# Altium schematic sheet DA2_SCH_PAGE2.SchDoc
size A3; SheetNumber: 2; SheetTotal: 2
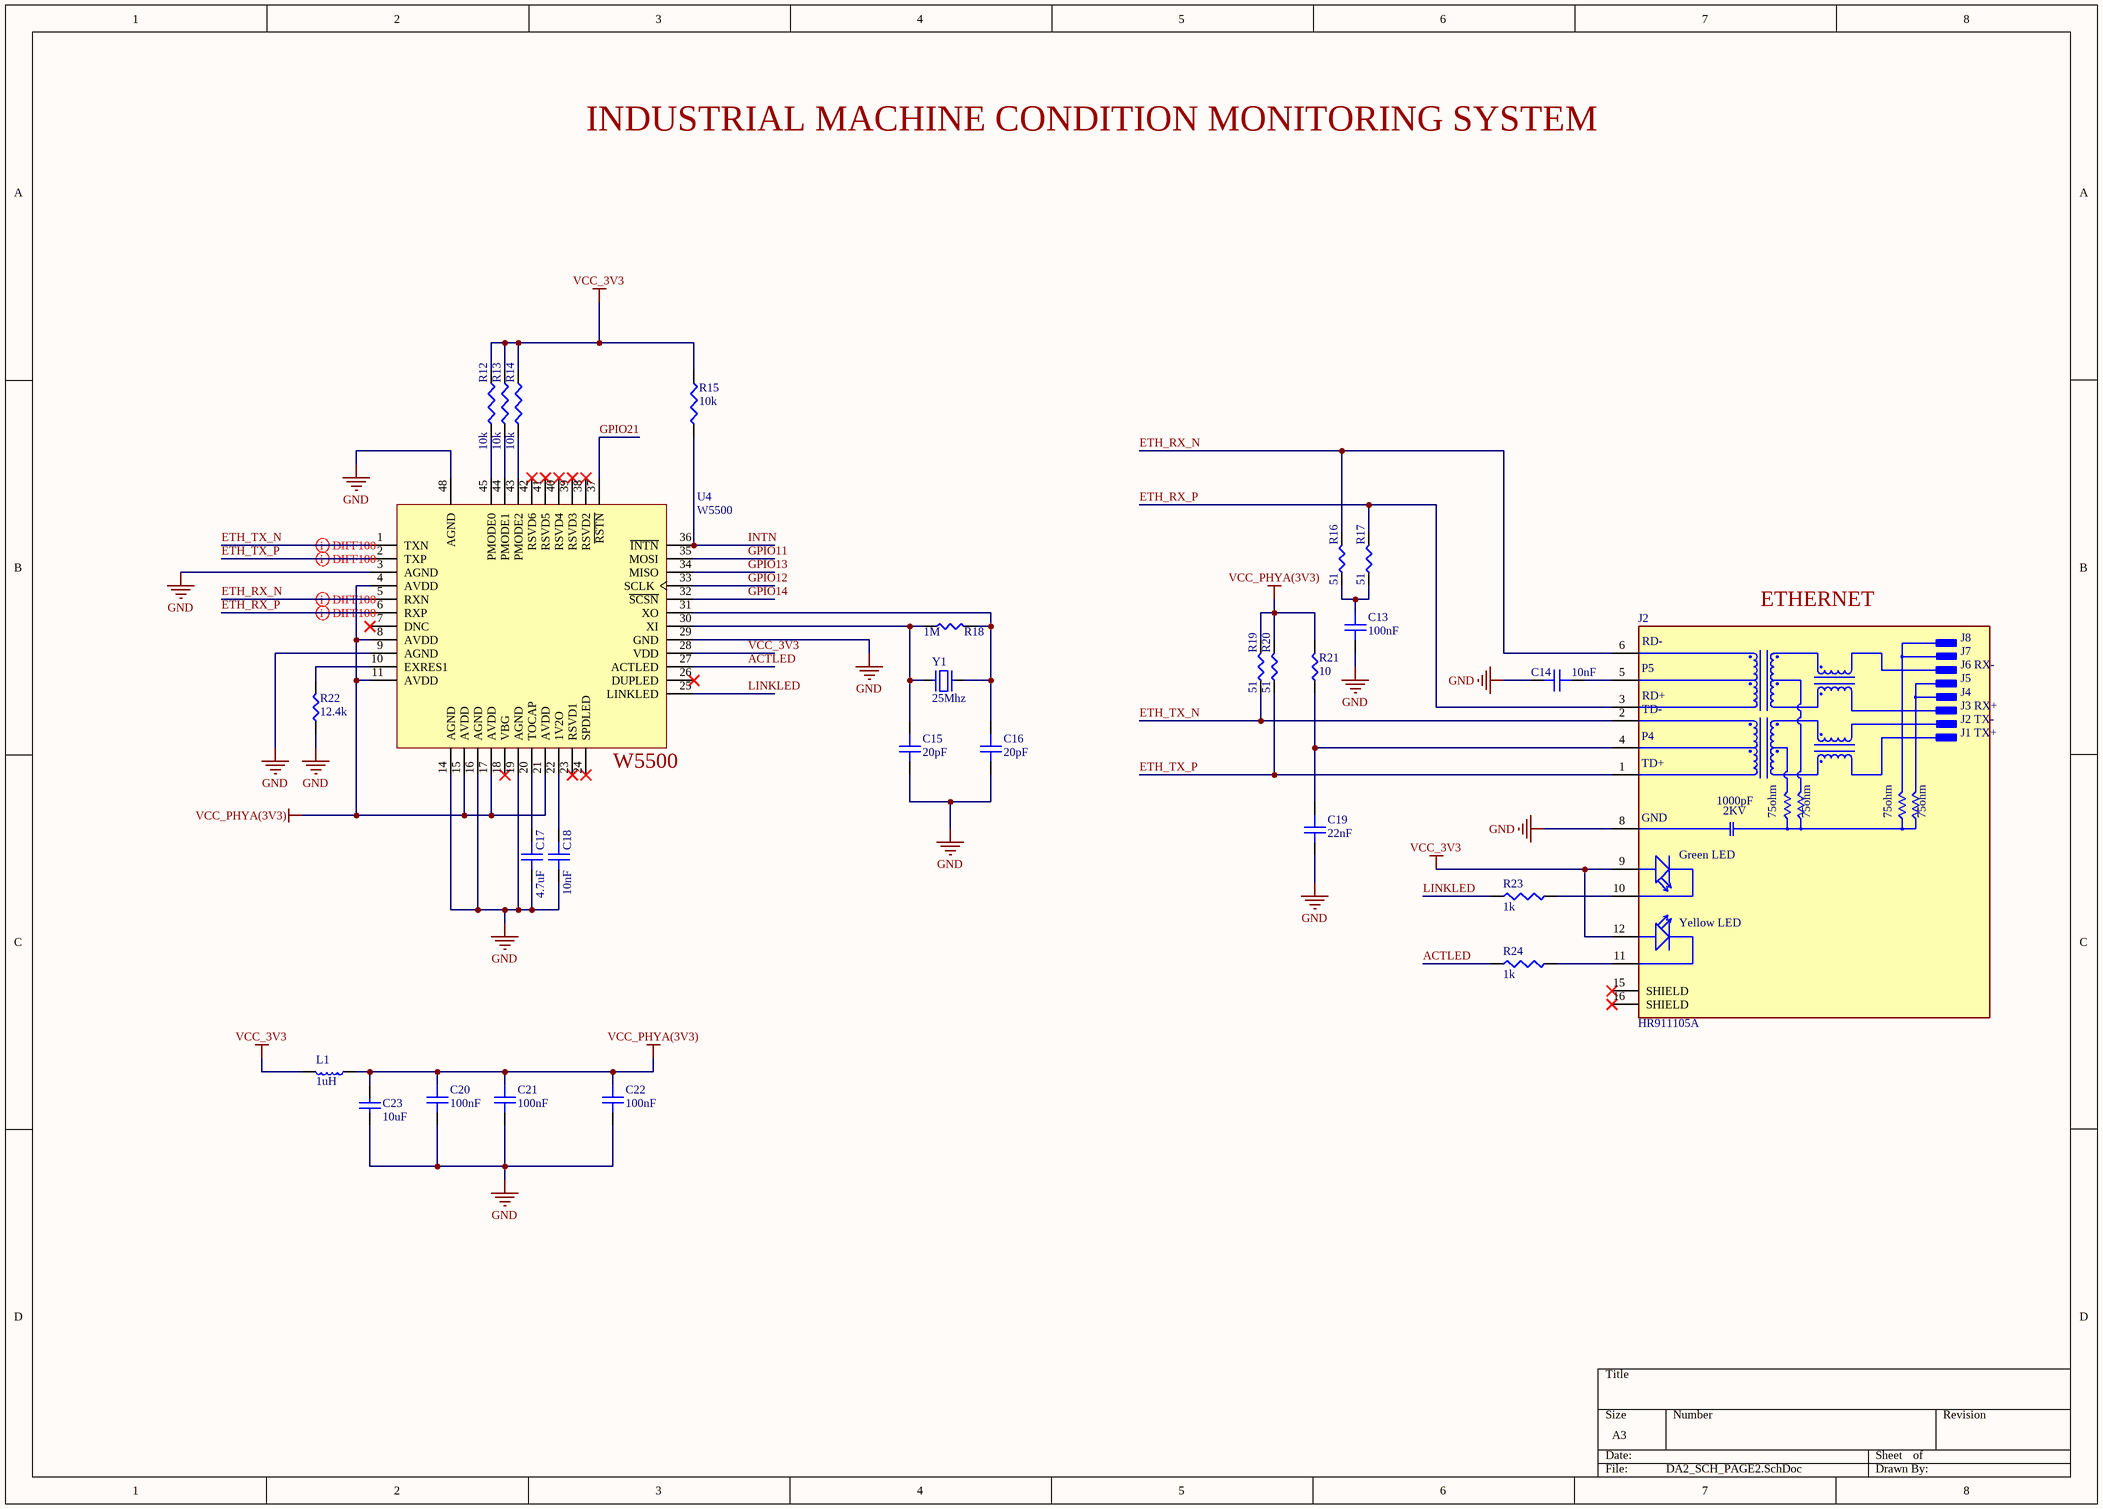
[diagram p0: DA2_SCH_PAGE2.SchDoc]

## Parts
C13  100nF  [tu 0805]
C14  10nF  [tu 0805]
C15  20pF  [tu 0805]
C16  20pF  [tu 0805]
C17  4.7uF  [Tu 0805]
C18  10nF  [tu 0805]
C19  22nF  [tu 0805]
C20  100nF  [tu 0805]
C21  100nF  [tu 0805]
C22  100nF  [tu 0805]
C23  10uF  [Tu 0805]
J2  HR911105A  [HANRUN_HR911105A]
L1  1uH  [Tu 0805]
R12  10k  [Tro SMD 0805]
R13  10k  [Tro SMD 0805]
R14  10k  [Tro SMD 0805]
R15  10k  [Tro SMD 0805]
R16  51  [tro smd 0805]
R17  51  [tro smd 0805]
R18  1M  [tro smd 0805]
R19  51  [tro smd 0805]
R20  51  [tro smd 0805]
R21  10  [tro smd 0805]
R22  12.4k  [tro smd 0805]
R23  1k  [Tro SMD 0805]
R24  1k  [Tro SMD 0805]
U4  W5500  [QFP50P900X900X160-48N]
Y1  25Mhz  [XTAL 25.000MHz]

## Nets
GND: C13.2 C14.2 C15.2 C16.2 C17.2 C18.2 C19.2 C20.2 C21.2 C22.2 C23.1 J2.8(GND) R22.1 U4.3(AGND) U4.9(AGND) U4.14(AGND) U4.16(AGND) U4.19(AGND) U4.29(GND) U4.48(AGND)
VCC_3V3: J2.9(GA) J2.12(YA) L1.1 R12.2 R13.2 R14.2 R15.2 U4.28(VDD)
VCC_PHYA(3V3): C20.1 C21.1 C22.1 C23.2 L1.2 R19.2 R20.2 R21.2 U4.4(AVDD) U4.8(AVDD) U4.11(AVDD) U4.15(AVDD) U4.17(AVDD) U4.21(AVDD)
ACTLED: R24.1 U4.27(ACTLED)
ETH_RX_N: J2.6(RD-) R16.2 U4.5(RXN)
ETH_RX_P: J2.3(RD+) R17.2 U4.6(RXP)
ETH_TX_N: J2.2(TD-) R19.1 U4.1(TXN)
ETH_TX_P: J2.1(TD+) R20.1 U4.2(TXP)
GPIO11: U4.35(MOSI)
GPIO12: U4.33(SCLK)
GPIO13: U4.34(MISO)
GPIO14: U4.32(~{SCSN})
GPIO21: U4.37(~{RSTN})
INTN: R15.1 U4.36(~{INTN})
LINKLED: R23.1 U4.25(LINKLED)
NetC13_1: C13.1 R16.1 R17.1
NetC14_1: C14.1 J2.5(P5)
NetC15_1: C15.1 R18.1 U4.30(XI) Y1.1
NetC16_1: C16.1 R18.2 U4.31(XO) Y1.2
NetC17_1: C17.1 U4.20(TOCAP)
NetC18_1: C18.1 U4.22(1V2O)
NetC19_1: C19.1 J2.4(P4) R21.1
NetJ2_10: J2.10(GC) R23.2
NetJ2_11: J2.11(YC) R24.2
NetR12_1: R12.1 U4.45(PMODE0)
NetR13_1: R13.1 U4.44(PMODE1)
NetR14_1: R14.1 U4.43(PMODE2)
NetR22_2: R22.2 U4.10(EXRES1)

Not connected (* = marked no-connect by the designer): J2 15(SHIELD)* 16(SHIELD)*; U4 7(DNC)* 18(VBG)* 23(RSVD1)* 24(SPDLED)* 26(DUPLED)* 38(RSVD2)* 39(RSVD3)* 40(RSVD4)* 41(RSVD5)* 42(RSVD6)*

## Layout directives
differential pair; differential pair class diff100: ETH_RX_N, ETH_RX_P, ETH_TX_N, ETH_TX_P

## Notes on the sheet
- INDUSTRIAL MACHINE CONDITION MONITORING SYSTEM
- ETHERNET
- (near U4) W5500
- (in symbol HR911105A) J8; J7; J6 RX-; J5; J4; J3 RX+; J2 TX-; J1 TX+; 1000pF; 2KV; 75ohm; Green LED; Yellow LED

## Library data of the parts
C13 C20-C22 = Tu 100nF: Dán 0805; Don_Vi: Con; So_Chan: 2; Ten_Linh_Kien: Tụ 0805 22nF 50V 20%; Ma_Hang: MH007857; Chung_Loai: Dán; Kieu_Chan: *
C14 C18 = Tu 10nF: Dán 0805; Don_Vi: Con; So_Chan: 2; Ten_Linh_Kien: Tụ 0805 22nF 50V 20%; Ma_Hang: MH007857; Chung_Loai: Dán; Kieu_Chan: *
C15 C16 = Tu  20pF: Dán 0805; Don_Vi: Con; Ten_Linh_Kien: Tụ 0805 20P 10% 50V; So_Chan: 2; Ma_Hang: MH004558; Chung_Loai: Dán; Kieu_Chan: *
C17 = Tu 4.7uF: Dán 0805; Ten_Linh_Kien: Tụ 0805 200p 10% 50V; Don_Vi: Con; So_Chan: 2; Ma_Hang: MH008100; Chung_Loai: Dán; Kieu_Chan: *
C19 = Tu 22nF: Dán 0805; Don_Vi: Con; Ten_Linh_Kien: Tụ 0805 20P 10% 50V; So_Chan: 2; Ma_Hang: MH004558; Chung_Loai: Dán; Kieu_Chan: *
C23 = Tu 10uF: Dán 0805; Manufacturer: Samsung Electro-Mechanics; Manufacturer Part Number: CL05A106MP5NUNC; Value: 10µF; Dielectric: X5R; Dielectric Material: Ceramic; Tolerance: 20%; Voltage Rating: 10V; Supplier: DigiKey; Supplier Part Number: 1276-1450-1-ND; RoHS: Compliant; Category: Ceramic Capacitors; Stock: 2239957; Pricing: 1=0.08, 10=0.038, 50=0.034, 100=0.0296, 500=0.0272, 1000=0.02, 2500=0.01844 (USD); Case/Package: 0402; Case Code (Imperial): 0402; Case Code (Metric): 1005; China RoHS: Compliant; Contact Plating: Tin; Depth: 500µm; Height: 700µm; Lead Free: Lead Free; Length: 1mm; Lifecycle Status: NRND; Material: Ceramic; Max Operating Temperature: 85°C; Min Operating Temperature: -55°C; Mounting Technology: Surface Mount; Number of Terminals: 2; Packaging: Tape and Reel; Radiation Hardening: No; REACH SVHC: Yes; Schedule B: 8532240020, 8532240020|8532240020|8532240020|8532240020|8532240020|8532240020|8532240020|8532240020|8532240020|8532240020|8532240020|8532240020|8532240020|8532240020|8532240020|8532240020|8532240020|8532240020|8532240020|8532240020|8532240020|8532240020|8532240020|85; Termination: Wraparound; Thickness: 711.2µm; Voltage Rating (DC): 10V; Width: 500µm; ComponentLink1URL: https://datasheet.octopart.com:443/CL05A106MP5NUNC-Samsung-Electro-Mechanics-datasheet-182018593.pdf?src-supplier=IHS; ComponentLink1Description: https://datasheet.octopart.com:443/CL05A106MP5NUNC-Samsung-Electro-Mechanics-datasheet-182018593.pdf?src-supplier=IHS; ComponentLink2URL: https://datasheet.octopart.com:443/CL05A106MP5NUNC-Samsung-Electro-Mechanics-datasheet-136031723.pdf?src-supplier=Upverter; ComponentLink2Description: https://datasheet.octopart.com:443/CL05A106MP5NUNC-Samsung-Electro-Mechanics-datasheet-136031723.pdf?src-supplier=Upverter; ComponentLink3URL: https://datasheet.octopart.com:443/CL05A106MP5NUNC-Samsung-Electro-Mechanics-datasheet-110226206.pdf?src-supplier=Future+Electronics; ComponentLink3Description: https://datasheet.octopart.com:443/CL05A106MP5NUNC-Samsung-Electro-Mechanics-datasheet-110226206.pdf?src-supplier=Future+Electronics; ComponentLink4URL: https://datasheet.octopart.com:443/CL05A106MP5NUNC-Samsung-Electro-Mechanics-datasheet-87580039.pdf?src-supplier=Future+Electronics; ComponentLink4Description: https://datasheet.octopart.com:443/CL05A106MP5NUNC-Samsung-Electro-Mechanics-datasheet-87580039.pdf?src-supplier=Future+Electronics; ComponentLink5URL: https://datasheet.octopart.com:443/CL05A106MP5NUNC-Samsung-Electro-Mechanics-datasheet-81461595.pdf?src-supplier=Future+Electronics; ComponentLink5Description: https://datasheet.octopart.com:443/CL05A106MP5NUNC-Samsung-Electro-Mechanics-datasheet-81461595.pdf?src-supplier=Future+Electronics; ComponentLink6URL: https://datasheet.octopart.com:443/CL05A106MP5NUNC-Samsung-datasheet-42280527.pdf?src-supplier=Future+Electronics; ComponentLink6Description: https://datasheet.octopart.com:443/CL05A106MP5NUNC-Samsung-datasheet-42280527.pdf?src-supplier=Future+Electronics; ComponentLink7URL: https://datasheet.octopart.com:443/CL05A106MP5NUNC-Samsung-datasheet-34153002.pdf?src-supplier=Future+Electronics; ComponentLink7Description: https://datasheet.octopart.com:443/CL05A106MP5NUNC-Samsung-datasheet-34153002.pdf?src-supplier=Future+Electronics; ComponentLink8URL: https://datasheet.octopart.com:443/CL05A106MP5NUNC-Samsung-datasheet-25077983.pdf?src-supplier=Future+Electronics; ComponentLink8Description: https://datasheet.octopart.com:443/CL05A106MP5NUNC-Samsung-datasheet-25077983.pdf?src-supplier=Future+Electronics; ComponentLink9URL: https://datasheet.octopart.com:443/CL05A106MP5NUNC-Samsung-Electro-Mechanics-datasheet-149136670.pdf?src-supplier=Future+Electronics; ComponentLink9Description: https://datasheet.octopart.com:443/CL05A106MP5NUNC-Samsung-Electro-Mechanics-datasheet-149136670.pdf?src-supplier=Future+Electronics; ComponentLink10URL: https://datasheet.octopart.com:443/CL05A106MP5NUNC-Samsung-datasheet-8326407.pdf?src-supplier=TME; ComponentLink10Description: https://datasheet.octopart.com:443/CL05A106MP5NUNC-Samsung-datasheet-8326407.pdf?src-supplier=TME; LCSC Part Number: C315248
J2 = HR911105A: DIP RJ45 Connector;; MF: hanrun; SnapEDA_Link: https://www.snapeda.com/parts/HR911105A/HanRun/view-part/?ref=snap; Package: None; MP: HR911105A; Check_prices: https://www.snapeda.com/parts/HR911105A/HanRun/view-part/?ref=eda; Price: None; Value: *; Availability: Not in stock
L1 = Cuon Cam 1uH: Dán 0805
R12-R15 = Tro 10k: Dán 0805; Manufacturer: Yageo Group; Manufacturer Part Number: RC0402FR-0710KL; Power Dissipation: 62.5mW; Power Rating: 63mW; Value: 10kΩ; Temperature Coefficient: 100ppm/°C; Tolerance: 1%; Voltage Rating: 50V; Supplier: DigiKey; Supplier Part Number: 311-10.0KLRCT-ND; RoHS: Compliant; Category: Chip SMD Resistors; Stock: 10693324; Pricing: 1=0.11, 10=0.011, 25=0.010, 50=0.0092, 100=0.0071, 250=0.00308, 10000=0.00286, 20000=0.00253, 30000=0.00237, 50000=0.0022, 70000=0.0021, 100000=0.002, 120000=0.00196, 240000=0.00182, 250000=0.00181 (USD); Case/Package: 0402; Case Code (Imperial): 0402; Case Code (Metric): 0402; China RoHS: Non-Compliant; Composition: Thick Film; Depth: 500µm; Height: 350µm; Lead Free: Lead Free; Lead Pitch: 200µm; Length: 1mm; Lifecycle Status: Production; Max Operating Temperature: 155°C; Military Standard: Not; Min Operating Temperature: -55°C; Mounting Technology: Surface Mount; Pins: 2; Number of Terminals: 2; Number of Terminations: 2; Packaging: Tape & Reel; REACH SVHC: Yes; Schedule B: 8533210045, 8533210045|8533210045|8533210045|8533210045|8533210045|8533210045|8533210045|8533210045|8533210045|8533210045|8533210045|8533210045|8533210045|8533210045, 8533210045|8533210045|8533210045|8533210045|8533210045|8533210045|8533210045|8533210045|8533210045|8533210045|8533210045|8533210045|8533210045|8533210045|8533210045, 8533210045|8533210045|8533210045|8533210045|8533210045|8533210045|8533210045|8533210045|8533210045|8533210045|8533210045|8533210045|8533210045|8533210045|8533210045|8533210045; Termination: SMD/SMT; Voltage Rating (DC): 50V; Width: 500µm; Working Voltage: 50V; ComponentLink1URL: https://datasheet.octopart.com:443/RC0402FR-0710KL-Yageo-datasheet-175887523.pdf?src-supplier=Newark; ComponentLink1Description: https://datasheet.octopart.com:443/RC0402FR-0710KL-Yageo-datasheet-175887523.pdf?src-supplier=Newark; ComponentLink2URL: https://datasheet.octopart.com:443/RC0402FR-0710KL-Yageo-datasheet-12531192.pdf?src-supplier=Newark; ComponentLink2Description: https://datasheet.octopart.com:443/RC0402FR-0710KL-Yageo-datasheet-12531192.pdf?src-supplier=Newark; ComponentLink3URL: https://datasheet.octopart.com:443/RC0402FR-0710KL-Yageo-datasheet-8324527.pdf?src-supplier=Newark; ComponentLink3Description: https://datasheet.octopart.com:443/RC0402FR-0710KL-Yageo-datasheet-8324527.pdf?src-supplier=Newark; ComponentLink4URL: https://datasheet.octopart.com:443/RC0402FR-0710KL-Yageo-datasheet-10408619.pdf?src-supplier=element14+APAC; ComponentLink4Description: https://datasheet.octopart.com:443/RC0402FR-0710KL-Yageo-datasheet-10408619.pdf?src-supplier=element14+APAC; ComponentLink5URL: https://datasheet.octopart.com:443/RC0402FR-0710KL-Yageo-datasheet-62067350.pdf?src-supplier=element14+APAC; ComponentLink5Description: https://datasheet.octopart.com:443/RC0402FR-0710KL-Yageo-datasheet-62067350.pdf?src-supplier=element14+APAC; ComponentLink6URL: https://datasheet.octopart.com:443/RC0402FR-0710KL-Yageo-datasheet-21426659.pdf?src-supplier=element14+APAC; ComponentLink6Description: https://datasheet.octopart.com:443/RC0402FR-0710KL-Yageo-datasheet-21426659.pdf?src-supplier=element14+APAC; ComponentLink7URL: https://datasheet.octopart.com:443/RC0402FR-0710KL-Yageo-datasheet-164759695.pdf?src-supplier=Upverter; ComponentLink7Description: https://datasheet.octopart.com:443/RC0402FR-0710KL-Yageo-datasheet-164759695.pdf?src-supplier=Upverter; ComponentLink8URL: https://datasheet.octopart.com:443/RC0402FR-0710KL-Yageo-datasheet-103092701.pdf?src-supplier=Upverter; ComponentLink8Description: https://datasheet.octopart.com:443/RC0402FR-0710KL-Yageo-datasheet-103092701.pdf?src-supplier=Upverter; ComponentLink9URL: https://sigma.octopart.com:443/138820526/technical_drawing/Yageo-RC0402FR-0710KL.pdf?src-supplier=Upverter; ComponentLink9Description: https://sigma.octopart.com:443/138820526/technical_drawing/Yageo-RC0402FR-0710KL.pdf?src-supplier=Upverter; ComponentLink10URL: https://datasheet.octopart.com:443/RC0402FR-0710KL-Yageo-datasheet-98239111.pdf?src-supplier=Upverter; ComponentLink10Description: https://datasheet.octopart.com:443/RC0402FR-0710KL-Yageo-datasheet-98239111.pdf?src-supplier=Upverter; ComponentLink11URL: https://datasheet.octopart.com:443/RC0402FR-0710KL-Yageo-datasheet-68298067.pdf?src-supplier=Upverter; ComponentLink11Description: https://datasheet.octopart.com:443/RC0402FR-0710KL-Yageo-datasheet-68298067.pdf?src-supplier=Upverter; ComponentLink12URL: https://datasheet.octopart.com:443/RC0402FR-0710KL-Yageo-datasheet-68297981.pdf?src-supplier=Upverter; ComponentLink12Description: https://datasheet.octopart.com:443/RC0402FR-0710KL-Yageo-datasheet-68297981.pdf?src-supplier=Upverter; ComponentLink13URL: https://datasheet.octopart.com:443/RC0402FR-0710KL-Yageo-datasheet-141435361.pdf?src-supplier=Upverter; ComponentLink13Description: https://datasheet.octopart.com:443/RC0402FR-0710KL-Yageo-datasheet-141435361.pdf?src-supplier=Upverter; ComponentLink14URL: https://datasheet.octopart.com:443/RC0402FR-0710KL-Yageo-datasheet-12509768.pdf?src-supplier=Upverter; ComponentLink14Description: https://datasheet.octopart.com:443/RC0402FR-0710KL-Yageo-datasheet-12509768.pdf?src-supplier=Upverter; ComponentLink15URL: https://datasheet.octopart.com:443/RC0402FR-0710KL-Yageo-datasheet-8329306.pdf?src-supplier=element14; ComponentLink15Description: https://datasheet.octopart.com:443/RC0402FR-0710KL-Yageo-datasheet-8329306.pdf?src-supplier=element14; ComponentLink16URL: https://datasheet.octopart.com:443/RC0402FR-0710KL-Yageo-datasheet-505231.pdf?src-supplier=element14; ComponentLink16Description: https://datasheet.octopart.com:443/RC0402FR-0710KL-Yageo-datasheet-505231.pdf?src-supplier=element14; ComponentLink17URL: https://datasheet.octopart.com:443/RC0402FR-0710KL-Yageo-datasheet-175423674.pdf?src-supplier=SOS+electronic; ComponentLink17Description: https://datasheet.octopart.com:443/RC0402FR-0710KL-Yageo-datasheet-175423674.pdf?src-supplier=SOS+electronic; ComponentLink18URL: https://datasheet.octopart.com:443/RC0402FR-0710KL-Yageo-datasheet-137700087.pdf?src-supplier=Future+Electronics; ComponentLink18Description: https://datasheet.octopart.com:443/RC0402FR-0710KL-Yageo-datasheet-137700087.pdf?src-supplier=Future+Electronics; ComponentLink19URL: https://datasheet.octopart.com:443/RC0402FR-0710KL-Yageo-datasheet-8324255.pdf?src-supplier=Future+Electronics; ComponentLink19Description: https://datasheet.octopart.com:443/RC0402FR-0710KL-Yageo-datasheet-8324255.pdf?src-supplier=Future+Electronics; ComponentLink20URL: https://datasheet.octopart.com:443/RC0402FR-0710KL-Yageo-datasheet-79472498.pdf?src-supplier=Megastar; ComponentLink20Description: https://datasheet.octopart.com:443/RC0402FR-0710KL-Yageo-datasheet-79472498.pdf?src-supplier=Megastar; ComponentLink21URL: https://datasheet.octopart.com/RC0402FR-0710KL-Yageo-datasheet-73766026.pdf; ComponentLink21Description: https://datasheet.octopart.com/RC0402FR-0710KL-Yageo-datasheet-73766026.pdf; ComponentLink22URL: http://sigma.octopart.com:80/rohs_statement/Yageo-company-2.pdf?src-supplier=Compliance+Statements; ComponentLink22Description: http://sigma.octopart.com:80/rohs_statement/Yageo-company-2.pdf?src-supplier=Compliance+Statements; ComponentLink23URL: http://sigma.octopart.com:80/conflict_mineral_statement/Yageo-company-3.pdf?src-supplier=Compliance+Statements; ComponentLink23Description: http://sigma.octopart.com:80/conflict_mineral_statement/Yageo-company-3.pdf?src-supplier=Compliance+Statements; LCSC Part Number: C60490
R16 R17 R19 R20 = Tro 51: Dán 0805; Don_Vi: Con; So_Chan: 2; Ten_Linh_Kien: Trở 0805 1% 49.9R; Ma_Hang: MH005480; Chung_Loai: Dán; Kieu_Chan: *
R18 = Tro 1M: Dán 0805; Don_Vi: Con; So_Chan: 2; Ten_Linh_Kien: Trở 0805 1% 49.9R; Ma_Hang: MH005480; Chung_Loai: Dán; Kieu_Chan: *
R21 = Tro 10: Dán 0805; Don_Vi: Con; So_Chan: 2; Ten_Linh_Kien: Trở 0805 1% 49.9R; Ma_Hang: MH005480; Chung_Loai: Dán; Kieu_Chan: *
R22 = Tro 12.4k: Dán 0805; Don_Vi: Con; So_Chan: 2; Ten_Linh_Kien: Trở 0805 1% 49.9R; Ma_Hang: MH005480; Chung_Loai: Dán; Kieu_Chan: *
R23 R24 = Tro 1k: Dán 0805; Manufacturer: Yageo Group; Manufacturer Part Number: RC0402JR-071KL; Max Power Dissipation: 63mW; Power Dissipation: 62.5mW; Value: 1kΩ; Temperature Coefficient: 100ppm/°C; Tolerance: 5%; Voltage Rating: 50V; Supplier: DigiKey; Supplier Part Number: 311-1.0KJRCT-ND; RoHS: Compliant; Category: Chip SMD Resistors; Stock: 6533264; Pricing: 1=0.1, 10=0.006, 25=0.0052, 50=0.004, 100=0.0036, 250=0.00284 (USD); Case/Package: 0402; Case Code (Imperial): 0402; China RoHS: Non-Compliant; Composition: Thick Film; Depth: 500µm; Features: Moisture Resistant; Height: 350µm; Lead Free: Lead Free; Length: 1mm; Lifecycle Status: Production; Max Operating Temperature: 155°C; Military Standard: Not; Min Operating Temperature: -55°C; Mounting Technology: Surface Mount; Pins: 2; Number of Terminals: 2; Number of Terminations: 2; Packaging: Tape & Reel; Power Rating: 62.5mW; REACH SVHC: Yes; Schedule B: 8533210045, 8533210045|8533210045, 8533210045|8533210045|8533210045, 8533210045|8533210045|8533210045|8533210045; Termination: SMD/SMT; Voltage Rating (AC): 50V; Voltage Rating (DC): 50V; Width: 500µm; Working Voltage: 50V; ComponentLink1URL: https://datasheet.octopart.com:443/RC0402JR-071KL-Yageo-datasheet-175887523.pdf?src-supplier=Farnell; ComponentLink1Description: https://datasheet.octopart.com:443/RC0402JR-071KL-Yageo-datasheet-175887523.pdf?src-supplier=Farnell; ComponentLink2URL: https://datasheet.octopart.com:443/RC0402JR-071KL-Yageo-datasheet-8324527.pdf?src-supplier=Farnell; ComponentLink2Description: https://datasheet.octopart.com:443/RC0402JR-071KL-Yageo-datasheet-8324527.pdf?src-supplier=Farnell; ComponentLink3URL: https://datasheet.octopart.com:443/RC0402JR-071KL-Yageo-datasheet-10408619.pdf?src-supplier=Newark; ComponentLink3Description: https://datasheet.octopart.com:443/RC0402JR-071KL-Yageo-datasheet-10408619.pdf?src-supplier=Newark; ComponentLink4URL: https://datasheet.octopart.com:443/RC0402JR-071KL-Yageo-datasheet-505231.pdf?src-supplier=Newark; ComponentLink4Description: https://datasheet.octopart.com:443/RC0402JR-071KL-Yageo-datasheet-505231.pdf?src-supplier=Newark; ComponentLink5URL: https://datasheet.octopart.com:443/RC0402JR-071KL-Yageo-datasheet-79472498.pdf?src-supplier=Upverter; ComponentLink5Description: https://datasheet.octopart.com:443/RC0402JR-071KL-Yageo-datasheet-79472498.pdf?src-supplier=Upverter; ComponentLink6URL: https://datasheet.octopart.com:443/RC0402JR-071KL-Yageo-datasheet-44585784.pdf?src-supplier=Upverter; ComponentLink6Description: https://datasheet.octopart.com:443/RC0402JR-071KL-Yageo-datasheet-44585784.pdf?src-supplier=Upverter; ComponentLink7URL: https://datasheet.octopart.com:443/RC0402JR-071KL-Yageo-datasheet-62067350.pdf?src-supplier=element14+APAC; ComponentLink7Description: https://datasheet.octopart.com:443/RC0402JR-071KL-Yageo-datasheet-62067350.pdf?src-supplier=element14+APAC; ComponentLink8URL: https://datasheet.octopart.com:443/RC0402JR-071KL-Yageo-datasheet-148775077.pdf?src-supplier=JRH+Electronics; ComponentLink8Description: https://datasheet.octopart.com:443/RC0402JR-071KL-Yageo-datasheet-148775077.pdf?src-supplier=JRH+Electronics; ComponentLink9URL: https://datasheet.octopart.com:443/RC0402JR-071KL-Yageo-datasheet-12531192.pdf?src-supplier=Seeed+Studio; ComponentLink9Description: https://datasheet.octopart.com:443/RC0402JR-071KL-Yageo-datasheet-12531192.pdf?src-supplier=Seeed+Studio; ComponentLink10URL: https://datasheet.octopart.com:443/RC0402JR-071KL-Yageo-datasheet-164759695.pdf?src-supplier=Future+Electronics; ComponentLink10Description: https://datasheet.octopart.com:443/RC0402JR-071KL-Yageo-datasheet-164759695.pdf?src-supplier=Future+Electronics; ComponentLink11URL: https://datasheet.octopart.com:443/RC0402JR-071KL-Yageo-datasheet-137700087.pdf?src-supplier=Future+Electronics; ComponentLink11Description: https://datasheet.octopart.com:443/RC0402JR-071KL-Yageo-datasheet-137700087.pdf?src-supplier=Future+Electronics; ComponentLink12URL: https://datasheet.octopart.com/RC0402JR-071KL-Yageo-datasheet-73766026.pdf; ComponentLink12Description: https://datasheet.octopart.com/RC0402JR-071KL-Yageo-datasheet-73766026.pdf; ComponentLink13URL: https://datasheet.octopart.com:443/RC0402JR-071KL-Yageo-datasheet-8329306.pdf?src-supplier=element14; ComponentLink13Description: https://datasheet.octopart.com:443/RC0402JR-071KL-Yageo-datasheet-8329306.pdf?src-supplier=element14; ComponentLink14URL: http://sigma.octopart.com:80/rohs_statement/Yageo-company-2.pdf?src-supplier=Compliance+Statements; ComponentLink14Description: http://sigma.octopart.com:80/rohs_statement/Yageo-company-2.pdf?src-supplier=Compliance+Statements; ComponentLink15URL: http://sigma.octopart.com:80/conflict_mineral_statement/Yageo-company-3.pdf?src-supplier=Compliance+Statements; ComponentLink15Description: http://sigma.octopart.com:80/conflict_mineral_statement/Yageo-company-3.pdf?src-supplier=Compliance+Statements; LCSC Part Number: C105637
U4 = W5500: Hardwired TCP/IP embedded Ethernet controller; Availability: Unavailable; MP: W5500; Value: *; Price: None; Package: None
Y1 = Thach Anh 2 chan SMD 5032: Crystal For all Crystal 2pin.; Value: 4Mhz